# EAGLE design UsbSwitch-Electron (EAGLE 7.4.0)
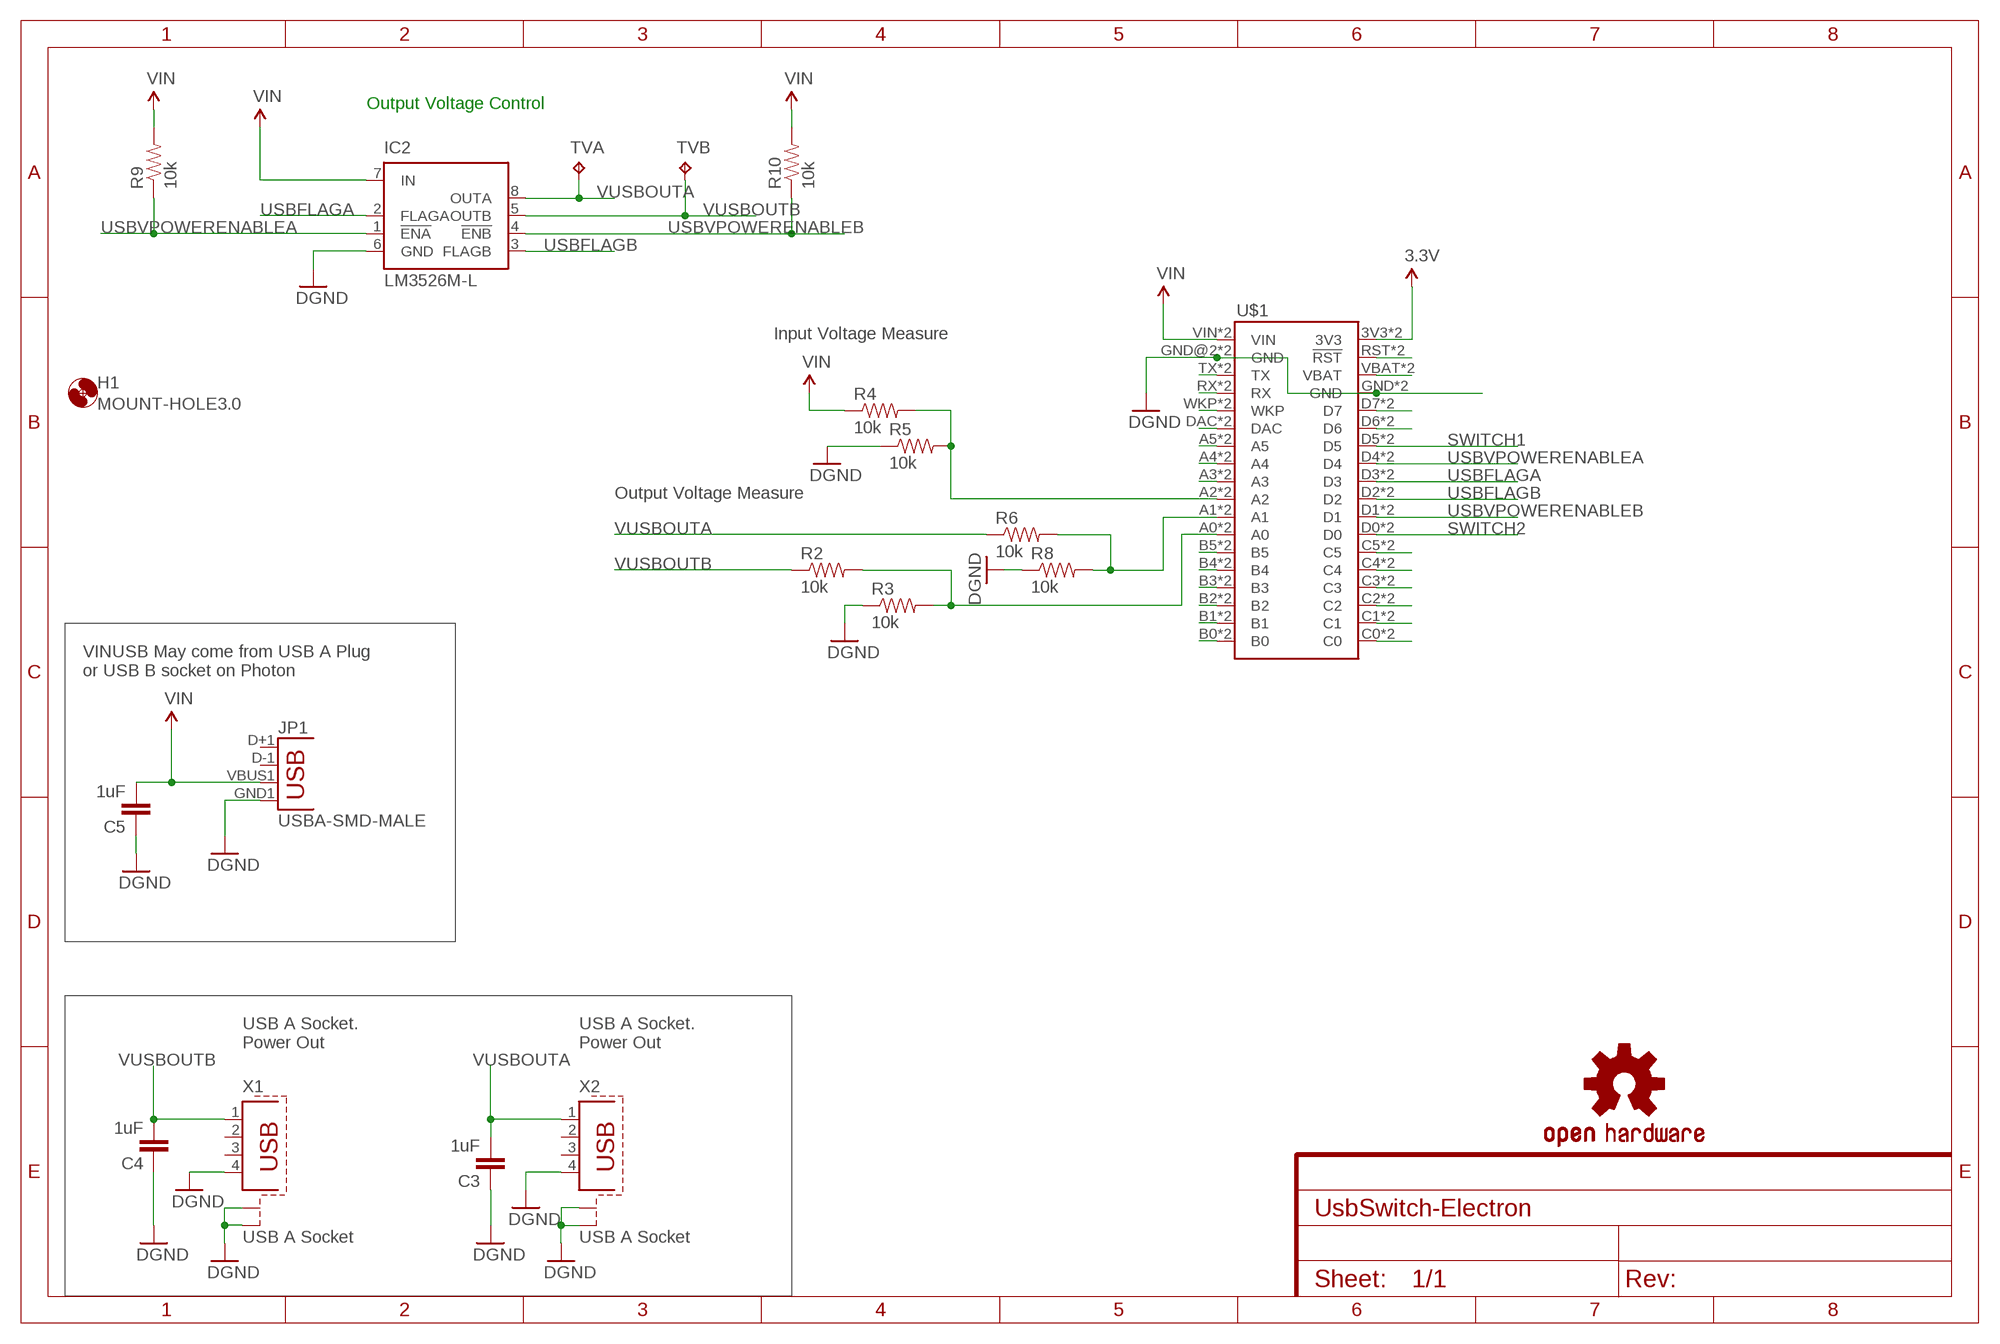
[diagram p0: schematic, sheet 1]

## Parts
C3  1uF  CAP0805  [0805]
C4  1uF  CAP0805  [0805]
C5  1uF  CAP0805  [0805]
H1  MOUNT-HOLE3.0  [3,0]
IC2  LM3526M-L  [SO08]
JP1  USBA-SMD-MALE  [USB-A-SMT-MALE]
LOGO2  OSHW-LOGOM  [OSHW-LOGO-M]
R2  10k  RESISTOR1206  [1206]
R3  10k  RESISTOR1206  [1206]
R4  10k  RESISTOR1206  [1206]
R5  10k  RESISTOR1206  [1206]
R6  10k  RESISTOR1206  [1206]
R8  10k  RESISTOR1206  [1206]
R9  10k  RESISTOR1206  [1206]
R10  10k  RESISTOR1206  [1206]
TVA  TPTP20SQ  [TP20SQ]
TVB  TPTP20SQ  [TP20SQ]
U$1  ELECTRONDUALNAMED  [ELECTRON_SIMPLE_SILK_NAMES_DUAL]
X1  USB A Socket  PN87520-S  [PN87520-S]
X2  USB A Socket  PN87520-S  [PN87520-S]

## Nets
3.3V: U$1.3V3 U$1.3V3_1(3V3)
GND: C3.1 C4.1 C5.1 IC2.6(GND) JP1.GND1(GND) R3.1 R5.1 R8.1 U$1.GND U$1.GND@2(GND) U$1.GND_1(GND) U$1.GND_1B(GND) X1.4 X1.S1 X1.S2 X2.4 X2.S1 X2.S2 ; supply symbol labelled DGND
N$4: U$1.TX U$1.TX_1(TX)
N$5: R6.2 R8.2 U$1.A1 U$1.A1_1(A1)
N$6: U$1.RX U$1.RX_1(RX)
N$7: U$1.WKP U$1.WKP_1(WKP)
N$11: U$1.DAC U$1.DAC_1(DAC)
N$12: U$1.D6 U$1.D6_1(D6)
N$13: U$1.D7 U$1.D7_1(D7)
N$14: U$1.VBAT U$1.VBATT_1(VBAT)
N$15: U$1.RST(!RST) U$1.RST_1(!RST)
N$16: U$1.C5 U$1.C5_1(C5)
N$19: U$1.C4 U$1.C4_1(C4)
N$20: U$1.C3 U$1.C3_1(C3)
N$21: R2.2 R3.2 U$1.A0 U$1.A0_1(A0)
N$22: U$1.C2 U$1.C2_1(C2)
N$23: R4.2 R5.2 U$1.A2 U$1.A2_1(A2)
N$24: U$1.C1 U$1.C1_1(C1)
N$25: U$1.C0 U$1.C0_1(C0)
N$26: U$1.A5 U$1.A5_1(A5)
N$27: U$1.A4 U$1.A4_1(A4)
N$28: U$1.A3 U$1.A3_1(A3)
N$29: U$1.B5 U$1.B5_1(B5)
N$30: U$1.B4 U$1.B4_1(B4)
N$31: U$1.B3 U$1.B3_1(B3)
N$32: U$1.B2 U$1.B2_1(B2)
N$33: U$1.B1 U$1.B1_1(B1)
N$34: U$1.B0 U$1.B0_1(B0)
SWITCH1: U$1.D5 U$1.D5_1(D5)
SWITCH2: U$1.D0 U$1.D0_1(D0)
USBFLAGA: IC2.2(FLAGA) U$1.D3 U$1.D3_1(D3)
USBFLAGB: IC2.3(FLAGB) U$1.D2 U$1.D2_1(D2)
USBVPOWERENABLEA: IC2.1(!ENA) R9.1 U$1.D4 U$1.D4_1(D4)
USBVPOWERENABLEB: IC2.4(!ENB) R10.1 U$1.D1 U$1.D1_1(D1)
VIN: C5.2 IC2.7(IN) JP1.VBUS1(VBUS) R4.1 R9.2 R10.2 U$1.VIN U$1.VIN_1B(VIN)
VUSBOUTA: C3.2 IC2.8(OUTA) R6.1 TVA.TP X2.1
VUSBOUTB: C4.2 IC2.5(OUTB) R2.1 TVB.TP X1.1
Unconnected: JP1.D+1(D+) JP1.D-1(D-) X1.2 X1.3 X2.2 X2.3

## Notes on the sheet
- Output Voltage Control
- Input Voltage Measure
- Output Voltage Measure
- VINUSB May come from USB A Plug 
  or USB B socket on Photon
- USB A Socket.
  Power Out
- USB A Socket.
  Power Out

## Library data of the parts
C3-C5 = SparkFun-Passives:CAP: Capacitor Standard 0603 ceramic capacitor, and 0.1" leaded capacitor.
H1 = holes:MOUNT-HOLE: MOUNTING HOLE with drill center marker
IC2 = SH-linear:LM3526M-L: Dual Port USB Power Switch and Over-Current Protection LOW active
JP1 = SparkFun-Connectors:USB: USB Connectors USB-B-PTH is fully proven SKU : PRT-00139/CONN-08278 USB-miniB is fully proven SKU : PRT-00587 USB-A-PCB is untested. USB-A-H is throughly reviewed, but untested. Spark Fun Electronics SKU : PRT-00437 USB-B-SMT is throughly reviewed, but untested. Needs silkscreen touching up. USB-A-S has not been used/tested USB-MB-H has not been used/tested USB-MICROB has been used. CONN-09505
LOGO2 = SparkFun-Aesthetics:OSHW-LOGO: Open Source Hardware Logo This logo indicates the piece of hardware it is found on incorporates a OSHW license and/or adheres to the definition of open source hardware found here: http://freedomdefined.org/OSHW
R2-R6 R8-R10 = SparkFun-Passives:RESISTOR: Resistor Basic schematic elements and footprints for 0603, 1206, and PTH resistors.
TVA TVB = testpad:TP: Test pad
U$1 = Tinamous:ELECTRON
X1 X2 = con-berg:PN87520-S; OC_FARNELL: unknown; OC_NEWARK: unknown

## Board
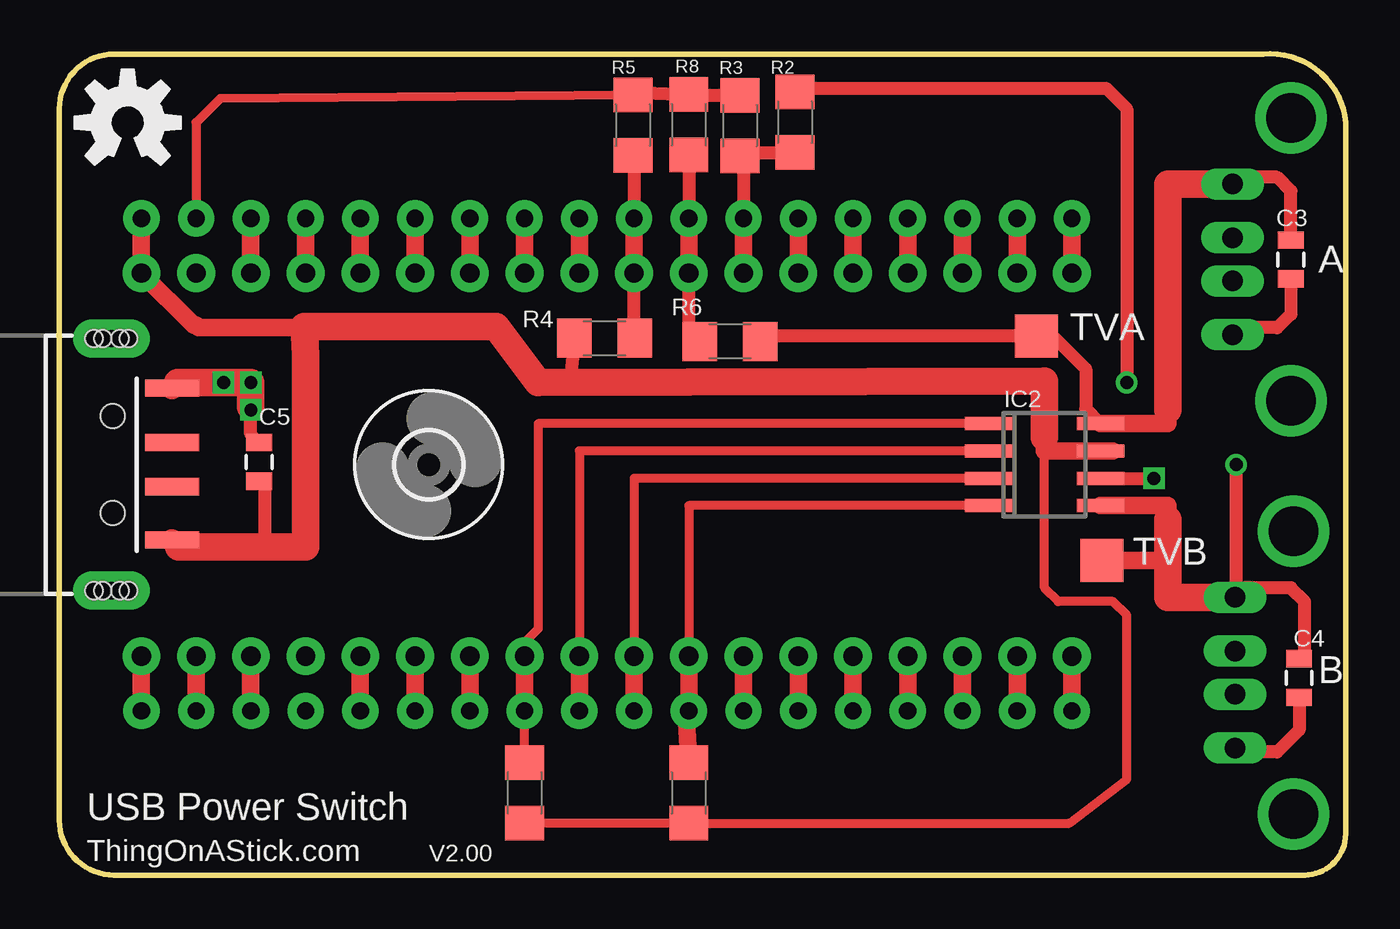
[diagram p1: board, top side]
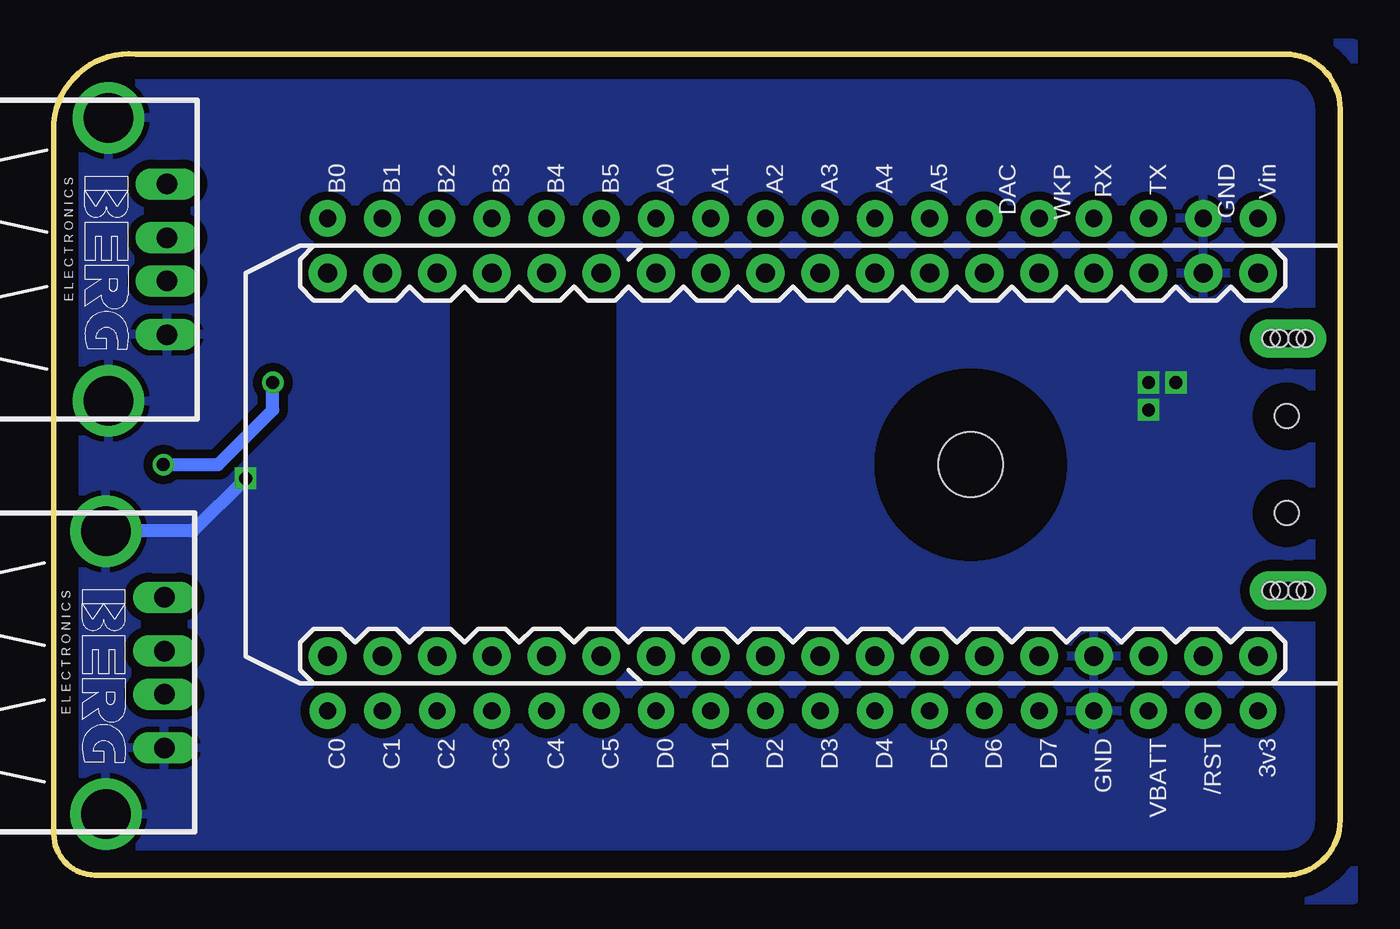
[diagram p2: board, bottom side, seen from below]

Size 59.69 x 38.11 mm. Coordinates in mm from the lower left corner, seen from the top.
Outline: 0,2.54 0,35.56 arc-90 2.54,38.1 55.88,38.1 arc-90 59.69,34.92 59.69,1.91 arc-90 57.79,0 2.54,0 arc-90 0,2.54
Copper layers (1*16): Top 0.035mm / dielectric 1.5mm / Bottom 0.035mm
Design rules "default": minimum track width 10mil, minimum drill 24mil, track to track 8mil, track to pad 8mil, pad to pad 8mil, via to via 8mil, smd to smd 8mil, copper to edge 40mil, drill to drill 8mil, minimum pad ring 10mil, minimum via ring 8mil, stop-mask expansion 4mil, vias tented up to drill 0mil, thermal gap 10mil

### Footprints (pad centres in the part's own frame; a part is rotated, then mirrored left to right if it is on the bottom)
0805 = smd 0.8 x 1.2: 1 -0.9,0; 2 0.9,0
3,0 = hole 3: 0,0
SO08 = smd 0.6 x 2.2: 1 -1.905,-2.6; 2 -0.635,-2.6; 3 0.635,-2.6; 4 1.905,-2.6; 5 1.905,2.6; 6 0.635,2.6; 7 -0.635,2.6; 8 -1.905,2.6
USB-A-SMT-MALE = smd 0.8 x 2.5: D+1 1.027,-5.87; D-1 -1.027,-5.87; GND1 3.551,-5.87; VBUS1 -3.5,-5.87 | drill 0.8 pad 1.778 long: P$1 5.85,-3.05; P$3 -5.85,-3.05 | hole 1.1: 2.25,-3.12; -2.25,-3.12 | hole 0.8: -5.85,-3.45; -5.85,-3.85; -5.85,-2.65; -5.85,-2.25; 5.85,-3.45; 5.85,-3.85; 5.85,-2.65; 5.85,-2.25
1206 = smd 1.6 x 1.8: 1 -1.4,0; 2 1.4,0
TP20SQ = smd 2 x 2: TP 0,0
ELECTRON_SIMPLE_SILK_NAMES_DUAL = drill 0.889 pad 1.753: 3V3 1.27,22.86; A0 29.21,5.08; A1 26.67,5.08; A2 24.13,5.08; A3 21.59,5.08; A4 19.05,5.08; A5 16.51,5.08; B0 44.45,5.08; B1 41.91,5.08; B2 39.37,5.08; B3 36.83,5.08; B4 34.29,5.08; B5 31.75,5.08; C0 44.45,22.86; C1 41.91,22.86; C2 39.37,22.86; C3 36.83,22.86; C4 34.29,22.86; C5 31.75,22.86; D0 29.21,22.86; D1 26.67,22.86; D2 24.13,22.86; D3 21.59,22.86; D4 19.05,22.86; D5 16.51,22.86; D6 13.97,22.86; D7 11.43,22.86; DAC 13.97,5.08; GND 8.89,22.86; GND@2 3.81,5.08; RST 3.81,22.86; RX 8.89,5.08; TX 6.35,5.08; VBAT 6.35,22.86; VIN 1.27,5.08; WKP 11.43,5.08 | drill 0.8 pad 1.676: 3V3_1 1.27,25.4; A0_1 29.21,2.54; A1_1 26.67,2.54; A2_1 24.13,2.54; A3_1 21.59,2.54; A4_1 19.05,2.54; A5_1 16.51,2.54; B0_1 44.45,2.54; B1_1 41.91,2.54; B2_1 39.37,2.54; B3_1 36.83,2.54; B4_1 34.29,2.54; B5_1 31.75,2.54; C0_1 44.45,25.4; C1_1 41.91,25.4; C2_1 39.37,25.4; C3_1 36.83,25.4; C4_1 34.29,25.4; C5_1 31.75,25.4; D0_1 29.21,25.4; D1_1 26.67,25.4; D2_1 24.13,25.4; D3_1 21.59,25.4; D4_1 19.05,25.4; D5_1 16.51,25.4; D6_1 13.97,25.4; D7_1 11.43,25.4; DAC_1 13.97,2.54; GND_1 8.89,25.4; GND_1B 3.81,2.54; RST_1 3.81,25.4; RX_1 8.89,2.54; TX_1 6.35,2.54; VBATT_1 6.35,25.4; VIN_1B 1.27,2.54; WKP_1 11.43,2.54
PN87520-S = drill 0.95 long: 1 -3.5,2.71; 2 -1,2.71; 3 1,2.71; 4 3.5,2.71 | drill 2.3 pad 2.9: S1 -6.57,0; S2 6.57,0

### Placement (x,y rotation side)
C3  57.15,28.58 90 top
C4  57.53,9.14 90 top
C5  9.27,19.18 270 top
H1  17.14,19.05 0 top
IC2  45.72,19.05 270 top
JP1  -0.64,19.05 90 top
LOGO2  3.17,34.92 0 top
R2  34.14,34.94 270 top
R3  31.58,34.79 270 top
R4  25.3,24.92 0 top
R5  26.62,34.8 270 top
R6  31.11,24.77 180 top
R8  29.21,34.83 270 top
R9  21.59,3.81 270 top
R10  29.21,3.81 270 top
TVA  45.34,25.02 0 top
TVB  48.39,14.61 0 top
U$1  2.54,33.02 180 bottom
X1  57.28,9.4 270 bottom
X2  57.15,28.58 270 bottom

### Tracks (layer width: path | path; a pad name or v marks a point on that pad's centre or on a via)
3.3V
  Top 0.813: U$1.3V3_1 U$1.3V3
GND  (via drill 0.6)
  Top 0.406: R5.1 7.47,36.04 6.35,34.92 U$1.GND_1B
  Top 0.61: 8.89,21.73 v8.89,21.59 8.89,20.46 C5.1 | C4.1 57.53,6.73 56.52,5.72 54.75,5.72 X1.4 | C3.1 57.15,26.03 56.52,25.4 54.77,25.4 X2.4 | R5.1 26.64,36.33 R8.1 29.35,36.19 R3.1 | IC2.6 v50.8,18.42
  Top 1.016: JP1.GND1 5.49,22.86
  Top 1.27: 5.49,22.86 v7.62,22.86 v8.89,22.86 8.89,21.73
  Bottom 0.61: v50.8,18.42 53.25,15.97 X1.S1
  pour Bottom (isolate 0.406): -0.64,38.61 33.4,38.61 33.4,-1.14 -0.64,-1.14
  pour Bottom (isolate 0.406): 60.33,38.99 33.66,38.99 33.66,27.05 34.93,27.05 34.93,28.07 41.53,28.07 41.53,10.54 35.56,10.54 35.56,11.56 33.4,11.56 33.4,-1.14 60.33,-1.14
N$4
  Top 0.813: U$1.TX_1 U$1.TX
N$5
  Top 0.61: R8.2 U$1.A1_1 | R6.2 29.21,25.27 U$1.A1
  Top 0.813: U$1.A1_1 U$1.A1
N$6
  Top 0.813: U$1.RX U$1.RX_1
N$7
  Top 0.813: U$1.WKP U$1.WKP_1
N$11
  Top 0.813: U$1.DAC_1 U$1.DAC
N$12
  Top 0.813: U$1.D6_1 U$1.D6
N$13
  Top 0.813: U$1.D7_1 U$1.D7
N$14
  Top 0.813: U$1.VBATT_1 U$1.VBAT
N$15
  Top 0.813: U$1.RST_1 U$1.RST
N$16
  Top 0.813: U$1.C5 U$1.C5_1
N$19
  Top 0.813: U$1.C4 U$1.C4_1
N$20
  Top 0.813: U$1.C3 U$1.C3_1
N$21
  Top 0.61: R3.2 31.75,33.22 | 31.75,33.22 U$1.A0_1 | 31.75,33.22 32.07,33.54 R2.2
  Top 0.813: U$1.A0 U$1.A0_1
N$22
  Top 0.813: U$1.C2 U$1.C2_1
N$23
  Top 0.61: R4.2 26.64,27.91 U$1.A2 | R5.2 26.67,33.25 U$1.A2_1
  Top 0.813: U$1.A2_1 U$1.A2
N$24
  Top 0.813: U$1.C1 U$1.C1_1
N$25
  Top 0.813: U$1.C0 U$1.C0_1
N$26
  Top 0.813: U$1.A5_1 U$1.A5
N$27
  Top 0.813: U$1.A4_1 U$1.A4
N$28
  Top 0.813: U$1.A3_1 U$1.A3
N$29
  Top 0.813: U$1.B5 U$1.B5_1
N$30
  Top 0.813: U$1.B4 U$1.B4_1
N$31
  Top 0.813: U$1.B3 U$1.B3_1
N$32
  Top 0.813: U$1.B2 U$1.B2_1
N$33
  Top 0.813: U$1.B1 U$1.B1_1
N$34
  Top 0.813: U$1.B0 U$1.B0_1
SWITCH1
  Top 0.813: U$1.D5 U$1.D5_1
SWITCH2
  Top 0.813: U$1.D0 U$1.D0_1
USBFLAGA
  Top 0.406: IC2.2 24.13,19.69 U$1.D3
  Top 0.813: U$1.D3 U$1.D3_1
USBFLAGB
  Top 0.406: IC2.3 26.67,18.42 U$1.D2
  Top 0.813: U$1.D2 U$1.D2_1
USBVPOWERENABLEA
  Top 0.406: IC2.1 22.22,20.95 22.22,11.43 21.59,10.8 U$1.D4 | R9.1 U$1.D4_1
  Top 0.813: U$1.D4 U$1.D4_1 21.46,7.49
USBVPOWERENABLEB
  Top 0.406: IC2.4 29.21,17.14 U$1.D1
  Top 0.813: U$1.D1 U$1.D1_1 29.08,7.49 R10.1
VIN
  Top 0.406: 45.72,19.69 45.72,13.34 46.36,12.7 48.9,12.7 49.53,12.06 49.53,4.45 46.86,2.41 R10.2 R9.2
  Top 0.61: 6.41,25.46 6.35,25.52 | C5.2 9.53,18.02 9.53,15.24 | R4.1 23.73,23.11 29.21,22.88
  Top 0.813: 45.72,20.32 45.72,19.69 IC2.7 48.9,19.69 | U$1.VIN_1B U$1.VIN 6.23,25.52 6.35,25.52 | 11.37,25.46 10.79,25.4 6.47,25.4 6.41,25.46
  Top 1.016: JP1.VBUS1 5.54,15.24
  Top 1.27: 5.54,15.24 9.53,15.24 11.43,15.24 11.43,24.13 11.37,25.46 20.26,25.46 22.22,22.86 29.21,22.88 45.72,22.92 45.72,20.32
VUSBOUTA
  Top 0.61: C3.2 57.15,31.75 56.52,32.39 54.75,32.39 X2.1 | IC2.8 47.62,21.65 47.62,23.5 46.1,25.02 TVA.TP 32.77,25.02 R6.1
  Top 0.813: 51.44,21.59 51.44,20.95 IC2.8 | 51.44,23.75 51.44,24.13
  Top 1.27: X2.1 51.44,32.08 51.44,24.13 51.44,21.59
VUSBOUTB  (via drill 0.6)
  Top 0.61: C4.2 57.79,10.04 57.79,12.7 57.15,13.34 55,13.34 X1.1 54.61,12.94 v54.61,19.05 | R2.1 34.6,36.51 48.58,36.51 49.53,35.56 v49.53,22.86
  Top 0.813: 51.44,16.51 51.44,17.14 IC2.5 | TVB.TP 51.44,14.61
  Top 1.27: X1.1 51.44,12.9 51.44,14.61 51.44,16.51
  Bottom 0.61: v54.61,19.05 52.07,19.05 49.53,21.59 v49.53,22.86

### Text on the board
tNames: A | B | USB Power Switch | ThingOnAStick.com | V2.00
Document: All Through Hole Parts mounted on PCB Bottom layer.